# EAGLE design Brava Pixle 6x6 Display (EAGLE 8.0.0)
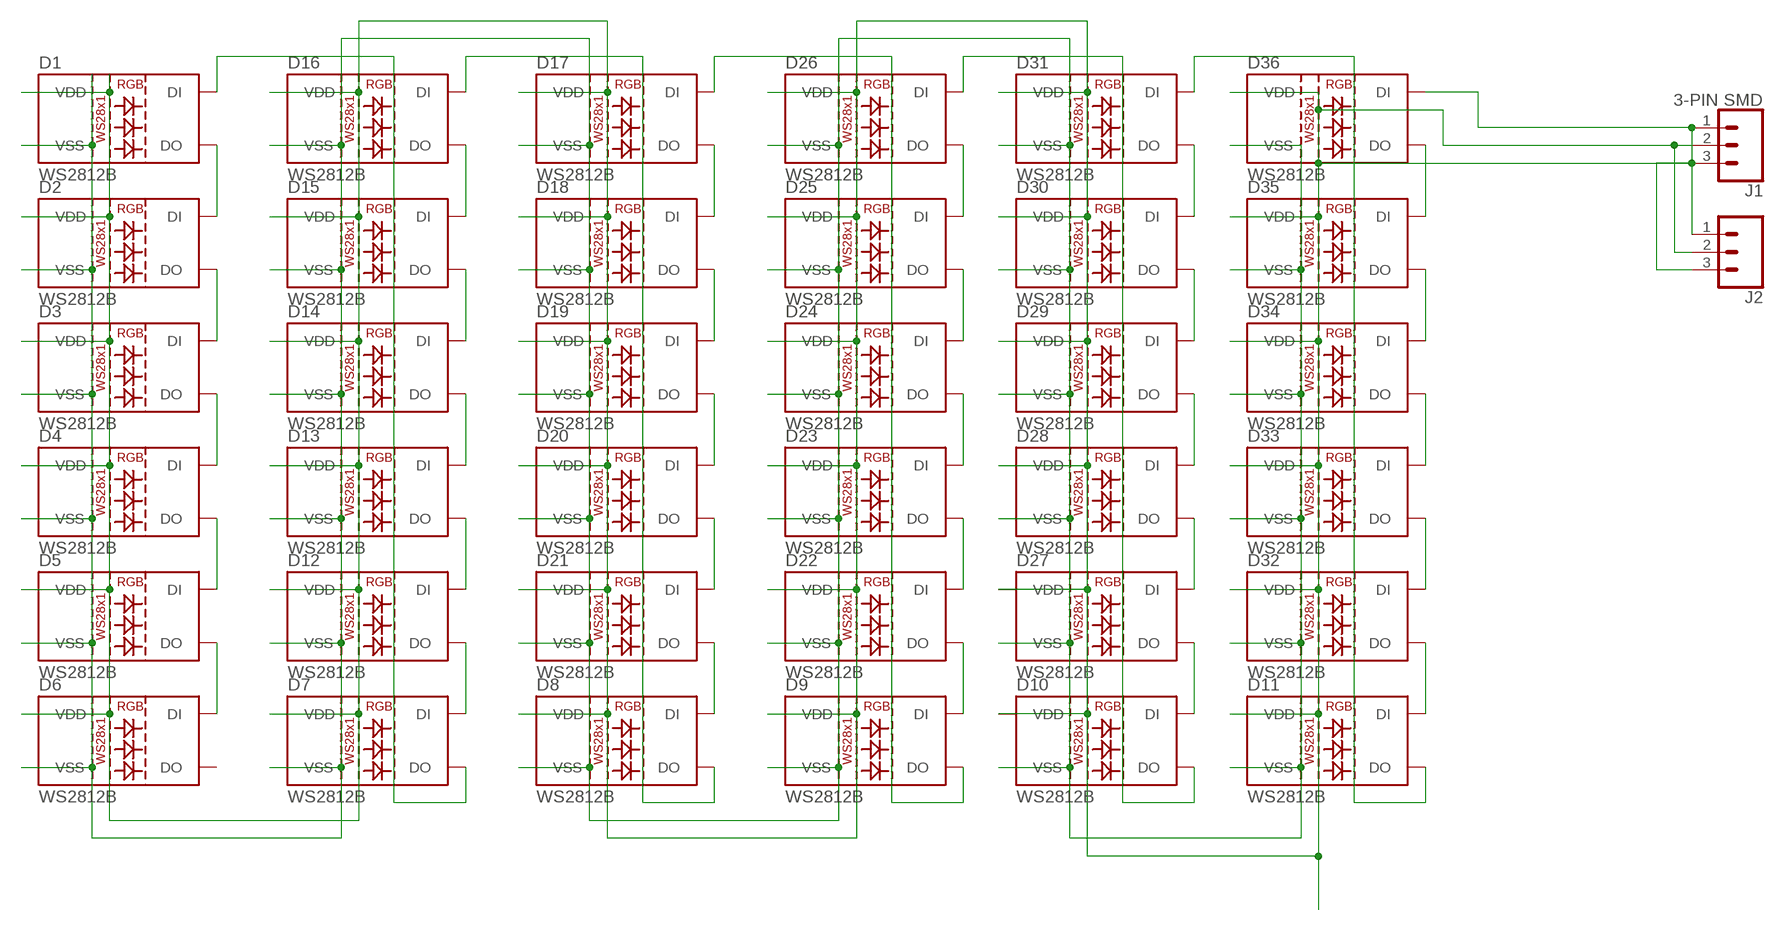
[diagram p0: schematic, sheet 1]

## Parts
D1  WS2812B  [WS2812B]
D2  WS2812B  [WS2812B]
D3  WS2812B  [WS2812B]
D4  WS2812B  [WS2812B]
D5  WS2812B  [WS2812B]
D6  WS2812B  [WS2812B]
D7  WS2812B  [WS2812B]
D8  WS2812B  [WS2812B]
D9  WS2812B  [WS2812B]
D10  WS2812B  [WS2812B]
D11  WS2812B  [WS2812B]
D12  WS2812B  [WS2812B]
D13  WS2812B  [WS2812B]
D14  WS2812B  [WS2812B]
D15  WS2812B  [WS2812B]
D16  WS2812B  [WS2812B]
D17  WS2812B  [WS2812B]
D18  WS2812B  [WS2812B]
D19  WS2812B  [WS2812B]
D20  WS2812B  [WS2812B]
D21  WS2812B  [WS2812B]
D22  WS2812B  [WS2812B]
D23  WS2812B  [WS2812B]
D24  WS2812B  [WS2812B]
D25  WS2812B  [WS2812B]
D26  WS2812B  [WS2812B]
D27  WS2812B  [WS2812B]
D28  WS2812B  [WS2812B]
D29  WS2812B  [WS2812B]
D30  WS2812B  [WS2812B]
D31  WS2812B  [WS2812B]
D32  WS2812B  [WS2812B]
D33  WS2812B  [WS2812B]
D34  WS2812B  [WS2812B]
D35  WS2812B  [WS2812B]
D36  WS2812B  [WS2812B]
J1  3-PIN SMD  CONN_03JST-SMD  [JST-3-SMD]
J2  CONN_03LONGPADS  [1X03_LONGPADS]

## Nets
N$1: D1.1(VDD) D2.1(VDD) D3.1(VDD) D4.1(VDD) D5.1(VDD) D6.1(VDD) D7.1(VDD) D8.1(VDD) D9.1(VDD) D10.1(VDD) D11.1(VDD) D12.1(VDD) D13.1(VDD) D14.1(VDD) D15.1(VDD) D16.1(VDD) D17.1(VDD) D18.1(VDD) D19.1(VDD) D20.1(VDD) D21.1(VDD) D22.1(VDD) D23.1(VDD) D24.1(VDD) D25.1(VDD) D26.1(VDD) D27.1(VDD) D28.1(VDD) D29.1(VDD) D30.1(VDD) D31.1(VDD) D32.1(VDD) D33.1(VDD) D34.1(VDD) D35.1(VDD) D36.1(VDD) J1.2 J1.3 J2.2 J2.3
N$2: D1.3(VSS) D2.3(VSS) D3.3(VSS) D4.3(VSS) D5.3(VSS) D6.3(VSS) D7.3(VSS) D8.3(VSS) D9.3(VSS) D10.3(VSS) D11.3(VSS) D12.3(VSS) D13.3(VSS) D14.3(VSS) D15.3(VSS) D16.3(VSS) D17.3(VSS) D18.3(VSS) D19.3(VSS) D20.3(VSS) D21.3(VSS) D22.3(VSS) D23.3(VSS) D24.3(VSS) D25.3(VSS) D26.3(VSS) D27.3(VSS) D28.3(VSS) D29.3(VSS) D30.3(VSS) D31.3(VSS) D32.3(VSS) D33.3(VSS) D34.3(VSS) D35.3(VSS) D36.3(VSS)
N$3: D36.4(DI) J1.1 J2.1
N$4: D35.4(DI) D36.2(DO)
N$5: D34.4(DI) D35.2(DO)
N$6: D33.4(DI) D34.2(DO)
N$7: D32.4(DI) D33.2(DO)
N$8: D11.4(DI) D32.2(DO)
N$9: D11.2(DO) D31.4(DI)
N$10: D30.4(DI) D31.2(DO)
N$11: D29.4(DI) D30.2(DO)
N$12: D28.4(DI) D29.2(DO)
N$13: D27.4(DI) D28.2(DO)
N$14: D10.4(DI) D27.2(DO)
N$15: D10.2(DO) D26.4(DI)
N$16: D25.4(DI) D26.2(DO)
N$17: D24.4(DI) D25.2(DO)
N$18: D23.4(DI) D24.2(DO)
N$19: D22.4(DI) D23.2(DO)
N$20: D9.4(DI) D22.2(DO)
N$21: D9.2(DO) D17.4(DI)
N$22: D17.2(DO) D18.4(DI)
N$23: D18.2(DO) D19.4(DI)
N$24: D19.2(DO) D20.4(DI)
N$25: D20.2(DO) D21.4(DI)
N$26: D8.4(DI) D21.2(DO)
N$27: D8.2(DO) D16.4(DI)
N$28: D15.4(DI) D16.2(DO)
N$29: D14.4(DI) D15.2(DO)
N$30: D13.4(DI) D14.2(DO)
N$31: D12.4(DI) D13.2(DO)
N$32: D7.4(DI) D12.2(DO)
N$33: D1.4(DI) D7.2(DO)
N$34: D1.2(DO) D2.4(DI)
N$35: D2.2(DO) D3.4(DI)
N$36: D3.2(DO) D4.4(DI)
N$37: D4.2(DO) D5.4(DI)
N$38: D5.2(DO) D6.4(DI)
Unconnected: D6.2(DO)

## Library data of the parts
D1-D36 = SparkFun-LED:WS2812B: WS2812B SMD addressable RGB LED 5x5mm SMD LED with built-in controller IC. Color: Red/Green/Blue mC Rating: RGB: 390, 660, 180 mcd Forward Voltage: RGB: 2.0, 3.0, 3.0 V Packages:WS2812B SparkFun Products: Blynk Board - ESP8266 <https://www.sparkfun.com/products/13794>; PROD_ID: DIO-12503
J1 = SparkFun-Connectors:CONN_03: Multi connection point. Often used as Generic Header-pin footprint for 0.1 inch spaced/style header connections On any of the 0.1 inch spaced packages, you can populate with these: Break Away Headers - Straight <https://www.sparkfun.com/products/116> (PRT-00116) Break Away Male Headers - Right Angle <https://www.sparkfun.com/products/553> (PRT-00553) Female Headers <https://www.sparkfun.com/products/115> (PRT-00115) Break Away Headers - Machine Pin <https://www.sparkfun.com/products/117> (PRT-00117) Break Away Female Headers - Swiss Machine Pin <https://www.sparkfun.com/products/743> (PRT-00743) Stackable Header - 3 Pin (Female, 0.1") <https://www.sparkfun.com/products/13875> (PRT-13875) For SCREWTERMINALS and SPRING TERMINALS visit here: Screw Terimnals on SparkFun.com <https://www.sparkfun.com/search/results?term=Screw+Terminals> (5mm/3.5mm/2.54mm spacing) This device is also useful as a general connection point to wire up your design to another part of your project. Our various solder wires solder well into these plated through hole pads. Hook-Up Wire - Assortment (Stranded, 22 AWG) <https://www.sparkfun.com/products/11375> (PRT-11375) Hook-Up Wire - Assortment (Solid Core, 22 AWG) <https://www.sparkfun.com/products/11367> (PRT-11367) View the entire wire category on our website here <https://www.sparkfun.com/categories/141> Special notes: Molex polarized connector foot print use with SKU : PRT-08232 with associated crimp pins and housings.; PROD_ID: CONN-12591
J2 = SparkFun-Connectors:CONN_03: Multi connection point. Often used as Generic Header-pin footprint for 0.1 inch spaced/style header connections On any of the 0.1 inch spaced packages, you can populate with these: Break Away Headers - Straight <https://www.sparkfun.com/products/116> (PRT-00116) Break Away Male Headers - Right Angle <https://www.sparkfun.com/products/553> (PRT-00553) Female Headers <https://www.sparkfun.com/products/115> (PRT-00115) Break Away Headers - Machine Pin <https://www.sparkfun.com/products/117> (PRT-00117) Break Away Female Headers - Swiss Machine Pin <https://www.sparkfun.com/products/743> (PRT-00743) Stackable Header - 3 Pin (Female, 0.1") <https://www.sparkfun.com/products/13875> (PRT-13875) For SCREWTERMINALS and SPRING TERMINALS visit here: Screw Terimnals on SparkFun.com <https://www.sparkfun.com/search/results?term=Screw+Terminals> (5mm/3.5mm/2.54mm spacing) This device is also useful as a general connection point to wire up your design to another part of your project. Our various solder wires solder well into these plated through hole pads. Hook-Up Wire - Assortment (Stranded, 22 AWG) <https://www.sparkfun.com/products/11375> (PRT-11375) Hook-Up Wire - Assortment (Solid Core, 22 AWG) <https://www.sparkfun.com/products/11367> (PRT-11367) View the entire wire category on our website here <https://www.sparkfun.com/categories/141> Special notes: Molex polarized connector foot print use with SKU : PRT-08232 with associated crimp pins and housings.

## Board
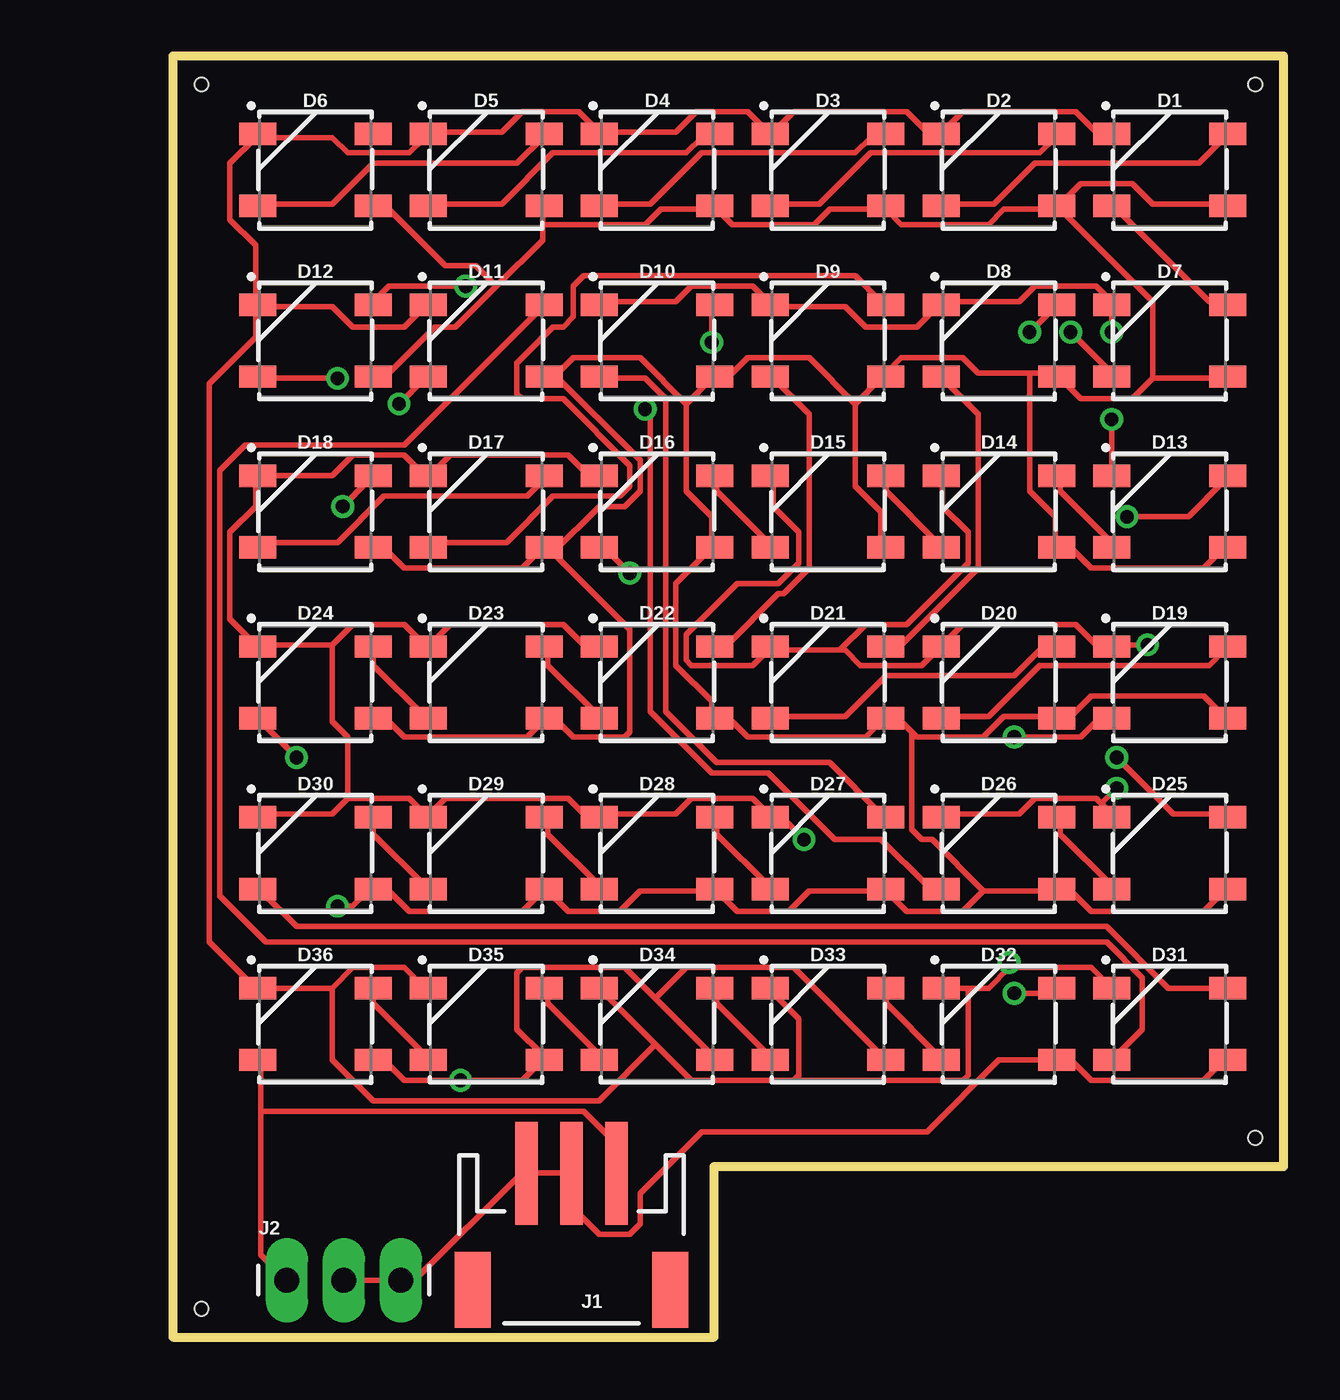
[diagram p1: board, top side]
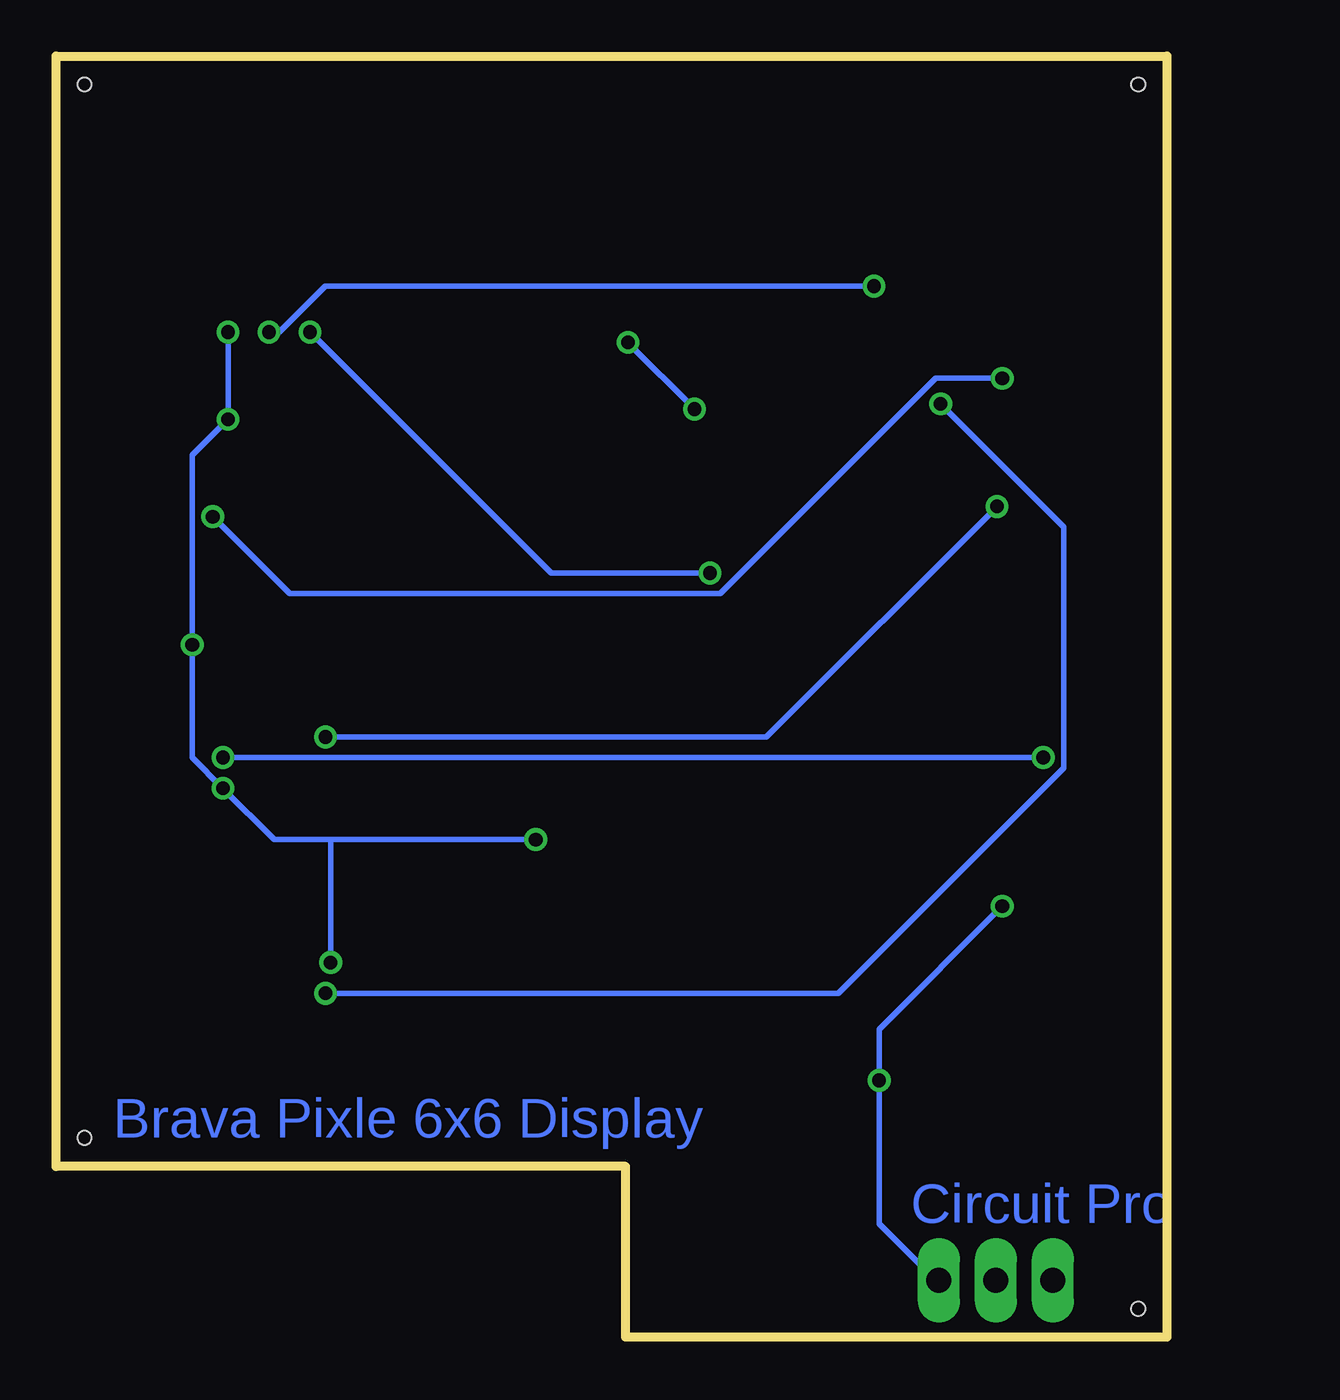
[diagram p2: board, bottom side, seen from below]

Size 49.53 x 57.15 mm. Coordinates in mm from the lower left corner, seen from the top.
Outline: 0,0 24.13,0 24.13,7.62 49.53,7.62 49.53,57.15 0,57.15 0,0
Copper layers (1*16): Top 0.035mm / dielectric 1.5mm / Bottom 0.035mm
Design rules "default": minimum track width 10mil, minimum drill 24mil, track to track 8mil, track to pad 8mil, pad to pad 8mil, via to via 8mil, smd to smd 8mil, copper to edge 40mil, drill to drill 8mil, minimum pad ring 10mil, minimum via ring 8mil, stop-mask expansion 4mil, vias tented up to drill 0mil, thermal gap 10mil
Holes 0.6 mm at 1.27,55.88 48.26,55.88 48.26,8.89 1.27,1.27 -58.42,34.29

### Footprints (pad centres in the part's own frame; a part is rotated, then mirrored left to right if it is on the bottom)
WS2812B = smd 1.651 x 1: 1 2.577,-1.6; 2 2.577,1.6; 3 -2.577,1.6; 4 -2.577,-1.6
JST-3-SMD = smd 1 x 4.6: 1 -1.99,-4.77; 2 0.01,-4.77; 3 2.01,-4.77 | smd 1.6 x 3.4: NC1 -4.39,0.43; NC2 4.41,0.43
1X03_LONGPADS = drill 1.118 pad 1.88 long: 1 0,0; 2 2.54,0; 3 5.08,0

### Placement (x,y rotation side)
D1  44.45,52.07 0 top
D2  36.83,52.07 0 top
D3  29.21,52.07 0 top
D4  21.59,52.07 0 top
D5  13.97,52.07 0 top
D6  6.35,52.07 0 top
D7  44.45,44.45 0 top
D8  36.83,44.45 0 top
D9  29.21,44.45 0 top
D10  21.59,44.45 0 top
D11  13.97,44.45 0 top
D12  6.35,44.45 0 top
D13  44.45,36.83 0 top
D14  36.83,36.83 0 top
D15  29.21,36.83 0 top
D16  21.59,36.83 0 top
D17  13.97,36.83 0 top
D18  6.35,36.83 0 top
D19  44.45,29.21 0 top
D20  36.83,29.21 0 top
D21  29.21,29.21 0 top
D22  21.59,29.21 0 top
D23  13.97,29.21 0 top
D24  6.35,29.21 0 top
D25  44.45,21.59 0 top
D26  36.83,21.59 0 top
D27  29.21,21.59 0 top
D28  21.59,21.59 0 top
D29  13.97,21.59 0 top
D30  6.35,21.59 0 top
D31  44.45,13.97 0 top
D32  36.83,13.97 0 top
D33  29.21,13.97 0 top
D34  21.59,13.97 0 top
D35  13.97,13.97 0 top
D36  6.35,13.97 0 top
J1  17.78,2.54 180 top
J2  5.08,2.54 0 top

### Tracks (layer width: path | path; a pad name or v marks a point on that pad's centre or on a via)
N$1  (via drill 0.61)
  Top 0.254: D36.1 9.4,12.37 10.31,11.45 v12.83,11.45 15.57,11.45 16.48,12.37 D35.1 16.48,12.6 15.34,13.74 15.34,16.26 15.57,16.48 20.14,16.48 21.51,15.11 | 21.51,15.11 24.03,12.6 D34.1 | 21.51,15.11 22.88,16.48 27.69,16.48 31.57,12.6 D33.1 | J2.2 J2.3 10.77,2.54 15.57,7.34 J1.3 15.8,7.34 17.63,7.34 J1.2 17.86,7.11 17.86,5.74 19,4.6 20.37,4.6 20.83,5.05 20.83,6.43 23.57,9.17 33.63,9.17 36.83,12.37 39.34,12.37 D32.1 39.57,12.37 40.03,12.37 40.95,11.45 45.97,11.45 46.89,12.37 D31.1 | 14.43,46.89 16.48,48.95 16.48,49.63 | 14.43,46.89 12.6,45.06 11.68,45.06 9.63,43 8.94,43 D12.1 | 16.48,49.63 16.48,50.32 D5.1 | 14.43,46.89 13.51,47.8 12.14,47.8 9.63,50.32 8.94,50.32 D6.1 | 16.48,49.63 21.06,49.63 21.74,50.32 24.03,50.32 D4.1 24.26,50.32 24.94,49.63 28.6,49.63 29.29,50.32 31.57,50.32 D3.1 31.8,50.32 32.49,49.63 36.37,49.63 37.06,50.32 39.34,50.32 D2.1 | D1.1 46.89,50.55 43.69,50.55 42.77,51.46 40.49,51.46 39.57,50.55 D2.1 | D25.1 46.89,19.91 45.97,19 40.95,19 40.03,19.91 39.57,19.91 D26.1 39.34,19.91 36.14,19.91 | 36.14,19.91 35.23,19 32.72,19 31.8,19.91 D27.1 31.57,19.91 28.37,19.91 27.46,19 25.17,19 24.26,19.91 D28.1 24.03,19.91 20.83,19.91 19.91,19 17.63,19 16.71,19.91 D29.1 16.48,19.91 15.57,19 10.54,19 9.63,19.91 8.94,19.91 D30.1 8.71,19.91 8.03,19.23 v7.34,19.23 | D19.1 46.89,27.69 45.97,28.6 40.95,28.6 40.03,27.69 39.57,27.69 D20.1 39.34,27.69 37.06,27.69 36.14,26.77 33.17,26.77 32.94,27 | 32.94,27 32.49,27.46 31.8,27.46 D21.1 31.57,27.46 30.89,26.77 25.63,26.77 24.94,27.46 24.26,27.46 D22.1 24.03,27.69 24.03,28.37 22.43,29.97 22.43,33.63 24.03,35.23 D16.1 24.03,35.46 24.03,36.6 22.88,37.74 22.88,41.63
  Top 0.254: D24.1 8.94,27.46 9.63,27.46 10.31,26.77 15.8,26.77 16.48,27.46 D23.1 16.71,27.46 17.17,27.46 17.86,26.77 20.14,26.77 20.37,27 20.37,31.57 16.94,35 | D18.1 9.4,35.23 10.31,34.31 15.57,34.31 16.48,35.23 D17.1 | 16.94,35 16.71,35.23 D17.1 | 22.88,41.63 24.03,42.77 D10.1 24.26,43 24.94,43 25.63,43.69 28.37,43.69 30.43,41.63 | 16.94,43 17.17,43 17.86,43.69 20.83,43.69 22.88,41.63 | 16.94,43 16.71,43 D11.1 16.94,43 | D13.1 46.89,35.23 45.97,34.31 40.95,34.31 40.03,35.23 39.57,35.23 D14.1 39.34,35.46 39.34,36.6 38.2,37.74 38.2,43 | 30.43,41.63 30.43,37.97 31.57,36.83 31.57,35.46 D15.1 | 30.43,41.63 31.57,42.77 D9.1 31.8,43 32.49,43.69 35.23,43.69 35.92,43 38.2,43 | 38.2,43 39.34,43 D8.1 39.57,42.77 40.49,41.86 42.77,41.86 43.69,42.77 | 43.69,42.77 46.89,42.77 D7.1 | 16.94,35 19,37.06 20.14,37.06 20.83,37.74 20.83,39.12 16.94,43 | 16.94,35 D17.1 | 36.14,19.91 33.86,22.2 33.4,22.2 32.94,22.66 32.94,27 | 43.69,42.77 43.69,46.2 39.57,50.32 D2.1
  Bottom 0.254: J2.3 10.31,2.54 12.83,5.05 v12.83,11.45 12.83,13.74 v7.34,19.23
N$2  (via drill 0.61)
  Top 0.254: D12.3 3.91,45.97 7.11,45.97 8.03,45.06 10.31,45.06 11.23,45.97 D11.3 | D12.3 3.68,46.2 3.68,48.72 2.54,49.86 2.54,52.38 3.68,53.52 D6.3 3.91,53.52 7.11,53.52 7.8,52.83 10.54,52.83 11.23,53.52 D5.3 11.45,53.75 14.66,53.75 15.57,54.66 18.09,54.66 19,53.75 D4.3 19.23,53.75 22.43,53.75 23.34,54.66 25.63,54.66 26.54,53.75 D3.3 26.77,53.75 27.69,54.66 32.72,54.66 33.63,53.75 34.09,53.75 D2.3 34.31,53.75 35.23,54.66 40.26,54.66 41.17,53.75 41.86,53.75 D1.3 | 35.46,15.57 36.37,15.57 37.29,16.48 | 35.46,15.57 34.31,15.57 D32.3 | 37.29,16.48 40.95,16.48 D31.3 | 7.11,15.57 3.91,15.57 D36.3 3.68,15.57 1.63,17.63 1.63,42.55 3.68,44.6 3.68,45.97 D12.3 | 7.11,15.57 8.03,16.48 10.31,16.48 11.23,15.57 D35.3 | 21.51,13.06 23.11,11.45 27.69,11.45 | 21.51,13.06 19.23,15.34 D34.3 | 27.69,11.45 27.91,11.68 27.91,14.2 26.77,15.34 D33.3 | 7.11,15.57 7.11,12.37 8.94,10.54 19,10.54 21.51,13.06 | 35.46,15.57 35.46,11.68 35.23,11.45 27.69,11.45 | D16.3 19,38.43 18.54,38.43 17.63,39.34 12.37,39.34 11.45,38.43 D17.3 11.23,38.43 10.31,39.34 8.03,39.34 7.11,38.43 3.91,38.43 D18.3 3.68,38.2 3.68,37.06 2.54,35.92 2.54,32.03 3.68,30.89 D24.3 3.91,30.89 7.11,30.89 | 7.8,24.03 7.11,23.34 3.91,23.34 D30.3 | 7.8,24.03 10.54,24.03 11.23,23.34 D29.3 11.45,23.34 12.14,24.03 17.63,24.03 18.31,23.34 19,23.34 D28.3 19.23,23.34 22.43,23.34 23.11,24.03 25.86,24.03 26.54,23.34 D27.3 26.77,23.11 27.23,23.11 v28.14,22.2 | 7.11,30.89 8.03,31.8 10.31,31.8 11.23,30.89 D23.3 11.45,30.89 12.37,31.8 17.4,31.8 18.31,30.89 19,30.89 D22.3 | 7.8,24.03 7.8,26.77 7.11,27.46 7.11,30.89
  Top 0.254: 29.74,30.66 29.97,30.66 30.66,29.97 33.4,29.97 34.09,30.66 D20.3 34.31,30.89 35.23,31.8 40.26,31.8 41.17,30.89 41.86,30.89 D19.3 42.09,30.89 v43.46,30.89 | 29.74,30.66 26.77,30.66 D21.3 26.54,30.66 25.86,29.97 23.11,29.97 22.88,30.2 22.88,31.34 25.17,33.63 27,33.63 27.91,34.54 27.91,35.92 26.77,37.06 26.77,38.2 D15.3 | 29.74,30.66 30.89,31.8 32.72,31.8 35.46,34.54 35.46,35.92 34.31,37.06 34.31,38.2 D14.3 | D10.3 19.23,46.2 22.43,46.2 23.11,46.89 25.86,46.89 26.54,46.2 D9.3 26.77,45.97 29.97,45.97 30.89,45.06 33.17,45.06 34.09,45.97 D8.3 34.31,46.2 37.74,46.2 38.43,46.89 41.17,46.89 41.86,46.2 D7.3 41.86,45.97 v41.86,44.83 | 41.4,23.8 41.86,23.34 D25.3 | 41.4,23.8 41.17,24.03 38.43,24.03 37.74,23.34 34.31,23.34 D26.3 | v41.86,40.95 D13.3 | v42.09,24.49 41.4,23.8 | v37.29,16.71 37.29,16.48
  Bottom 0.254: v41.86,44.83 v41.86,40.95 43.46,39.34 v43.46,30.89 43.46,25.86 v42.09,24.49 39.8,22.2 37.29,22.2 | 37.29,22.2 v28.14,22.2 | 37.29,22.2 v37.29,16.71
N$3
  Top 0.254: 3.91,10.08 3.91,3.68 5.05,2.54 J2.1 | 3.91,10.08 3.91,12.37 D36.4 | 3.91,10.08 18.31,10.08 19.68,8.71 19.68,7.34 J1.1
N$4
  Top 0.254: D36.2 8.94,15.34 8.94,14.88 11.23,12.6 D35.4
N$5
  Top 0.254: D35.2 16.71,15.34 16.71,14.88 19,12.6 D34.4
N$6
  Top 0.254: D34.2 24.26,15.34 24.26,14.88 26.54,12.6 D33.4
N$7
  Top 0.254: D33.2 31.8,15.34 31.8,14.88 34.09,12.6 D32.4
N$8  (via drill 0.61)
  Top 0.254: v37.52,15.34 39.34,15.34 D32.2 | v10.08,41.63 11.23,42.77 D11.4
  Bottom 0.254: v37.52,15.34 14.66,15.34 4.6,25.4 4.6,36.14 v10.08,41.63
N$9
  Top 0.254: D11.2 16.48,45.97 10.31,39.8 3.23,39.8 2.08,38.66 2.08,19.68 4.14,17.63 41.63,17.63 43.23,16.03 43.23,13.74 42.09,12.6 D31.4
N$10
  Top 0.254: D31.2 46.89,15.57 44.37,15.57 41.63,18.31 5.51,18.31 3.91,19.91 D30.4
N$11
  Top 0.254: D30.2 8.94,23.11 8.94,22.43 11.23,20.14 D29.4
N$12
  Top 0.254: D29.2 16.71,23.11 16.71,22.43 19,20.14 D28.4
N$13
  Top 0.254: D28.2 24.26,23.11 24.26,22.43 26.54,20.14 D27.4
N$14
  Top 0.254: D10.4 19.23,42.77 21.06,42.77 21.97,41.86 21.97,27.91 24.26,25.63 29.29,25.63 31.57,23.34 D27.2
N$15  (via drill 0.61)
  Top 0.254: v21.06,41.4 21.29,41.17 21.29,27.91 24.03,25.17 26.54,25.17 29.52,22.2 31.57,22.2 33.63,20.14 34.09,20.14 D26.4 | v24.03,44.37 24.03,45.97 D10.2
  Bottom 0.254: v24.03,44.37 v21.06,41.4
N$16
  Top 0.254: D26.2 39.57,23.11 39.57,22.43 41.86,20.14 D25.4
N$17  (via drill 0.61)
  Top 0.254: v42.09,25.86 44.6,23.34 46.89,23.34 D25.2 | v5.51,25.86 3.91,27.46 D24.4
  Bottom 0.254: v5.51,25.86 v42.09,25.86
N$18
  Top 0.254: D24.2 8.94,30.66 8.94,29.97 11.23,27.69 D23.4
N$19
  Top 0.254: D23.2 16.71,30.66 16.71,29.97 19,27.69 D22.4
N$20
  Top 0.254: D22.2 24.26,30.89 24.71,30.89 27,33.17 27.23,33.17 28.37,34.31 28.37,41.17 26.77,42.77 D9.4
N$21
  Top 0.254: D17.4 11.45,35.46 14.88,35.46 16.94,37.52 19.91,37.52 20.37,37.97 20.37,38.89 17.4,41.86 15.57,41.86 15.34,42.09 15.34,43.46 16.94,45.06 17.4,45.06 17.86,45.52 17.86,46.89 18.31,47.35 30.43,47.35 31.57,46.2 D9.2
N$22
  Top 0.254: D18.4 3.91,35.46 7.34,35.46 9.4,37.52 15.8,37.52 16.48,38.2 D17.2
N$23  (via drill 0.61)
  Top 0.254: v37.52,26.77 40.49,26.77 41.17,27.46 41.86,27.46 D19.4 | v7.57,37.06 8.71,38.2 D18.2
  Bottom 0.254: v37.52,26.77 17.86,26.77 v7.57,37.06
N$24
  Top 0.254: D20.4 34.31,27.69 36.37,27.69 38.66,29.97 46.2,29.97 46.89,30.66 D19.2
N$25
  Top 0.254: D21.4 26.77,27.69 29.97,27.69 31.8,29.52 37.52,29.52 38.66,30.66 39.34,30.66 D20.2
N$26
  Top 0.254: D21.2 31.8,30.89 32.49,30.89 35.92,34.31 35.92,41.17 34.31,42.77 D8.4
N$27  (via drill 0.61)
  Top 0.254: v20.37,34.09 19.23,35.23 D16.4 | v38.2,44.83 39.34,45.97 D8.2
  Bottom 0.254: v20.37,34.09 27.46,34.09 v38.2,44.83
N$28
  Top 0.254: D16.2 24.26,38.2 24.26,37.74 26.54,35.46 D15.4
N$29
  Top 0.254: D15.2 31.8,38.2 31.8,37.74 34.09,35.46 D14.4
N$30
  Top 0.254: D14.2 39.57,38.2 39.57,37.74 41.86,35.46 D13.4
N$31  (via drill 0.61)
  Top 0.254: v7.34,42.77 3.91,42.77 D12.4 | v42.55,36.6 45.29,36.6 46.89,38.2 D13.2
  Bottom 0.254: v7.34,42.77 10.31,42.77 19.91,33.17 39.12,33.17 v42.55,36.6
N$32  (via drill 0.61)
  Top 0.254: v40.03,44.83 41.86,43 D7.4 | v13.06,46.89 9.63,46.89 8.94,46.2 D12.2
  Bottom 0.254: v40.03,44.83 39.57,44.83 37.52,46.89 v13.06,46.89
N$33
  Top 0.254: D7.2 46.89,46.2 46.2,46.2 42.09,50.32 D1.4
N$34
  Top 0.254: D2.4 34.31,50.55 36.6,50.55 38.43,52.38 45.74,52.38 46.89,53.52 D1.2
N$35
  Top 0.254: D3.4 26.77,50.55 28.83,50.55 31.11,52.83 38.66,52.83 39.34,53.52 D2.2
N$36
  Top 0.254: D4.4 19.23,50.55 21.29,50.55 23.57,52.83 30.43,52.83 31.11,53.52 31.57,53.52 D3.2
N$37
  Top 0.254: D5.4 11.45,50.55 14.66,50.55 16.94,52.83 22.88,52.83 23.57,53.52 24.03,53.52 D4.2
N$38
  Top 0.254: D6.4 3.91,50.55 7.11,50.55 8.94,52.38 15.34,52.38 16.48,53.52 D5.2

### Text on the board
Bottom: Brava Pixle 6x6 Display | Circuit Pro